# Altium schematic sheet CLK_Distribution.SchDoc
size 420 x 297 mm; EDA_Number: ARTIQ; CompanyName: WUT ISE; Organization: WUT ISE; DocumentNumber: 5; SheetNumber: 8; ModifiedBy: -; Title2: Clock distribution; ModifiedDate: -
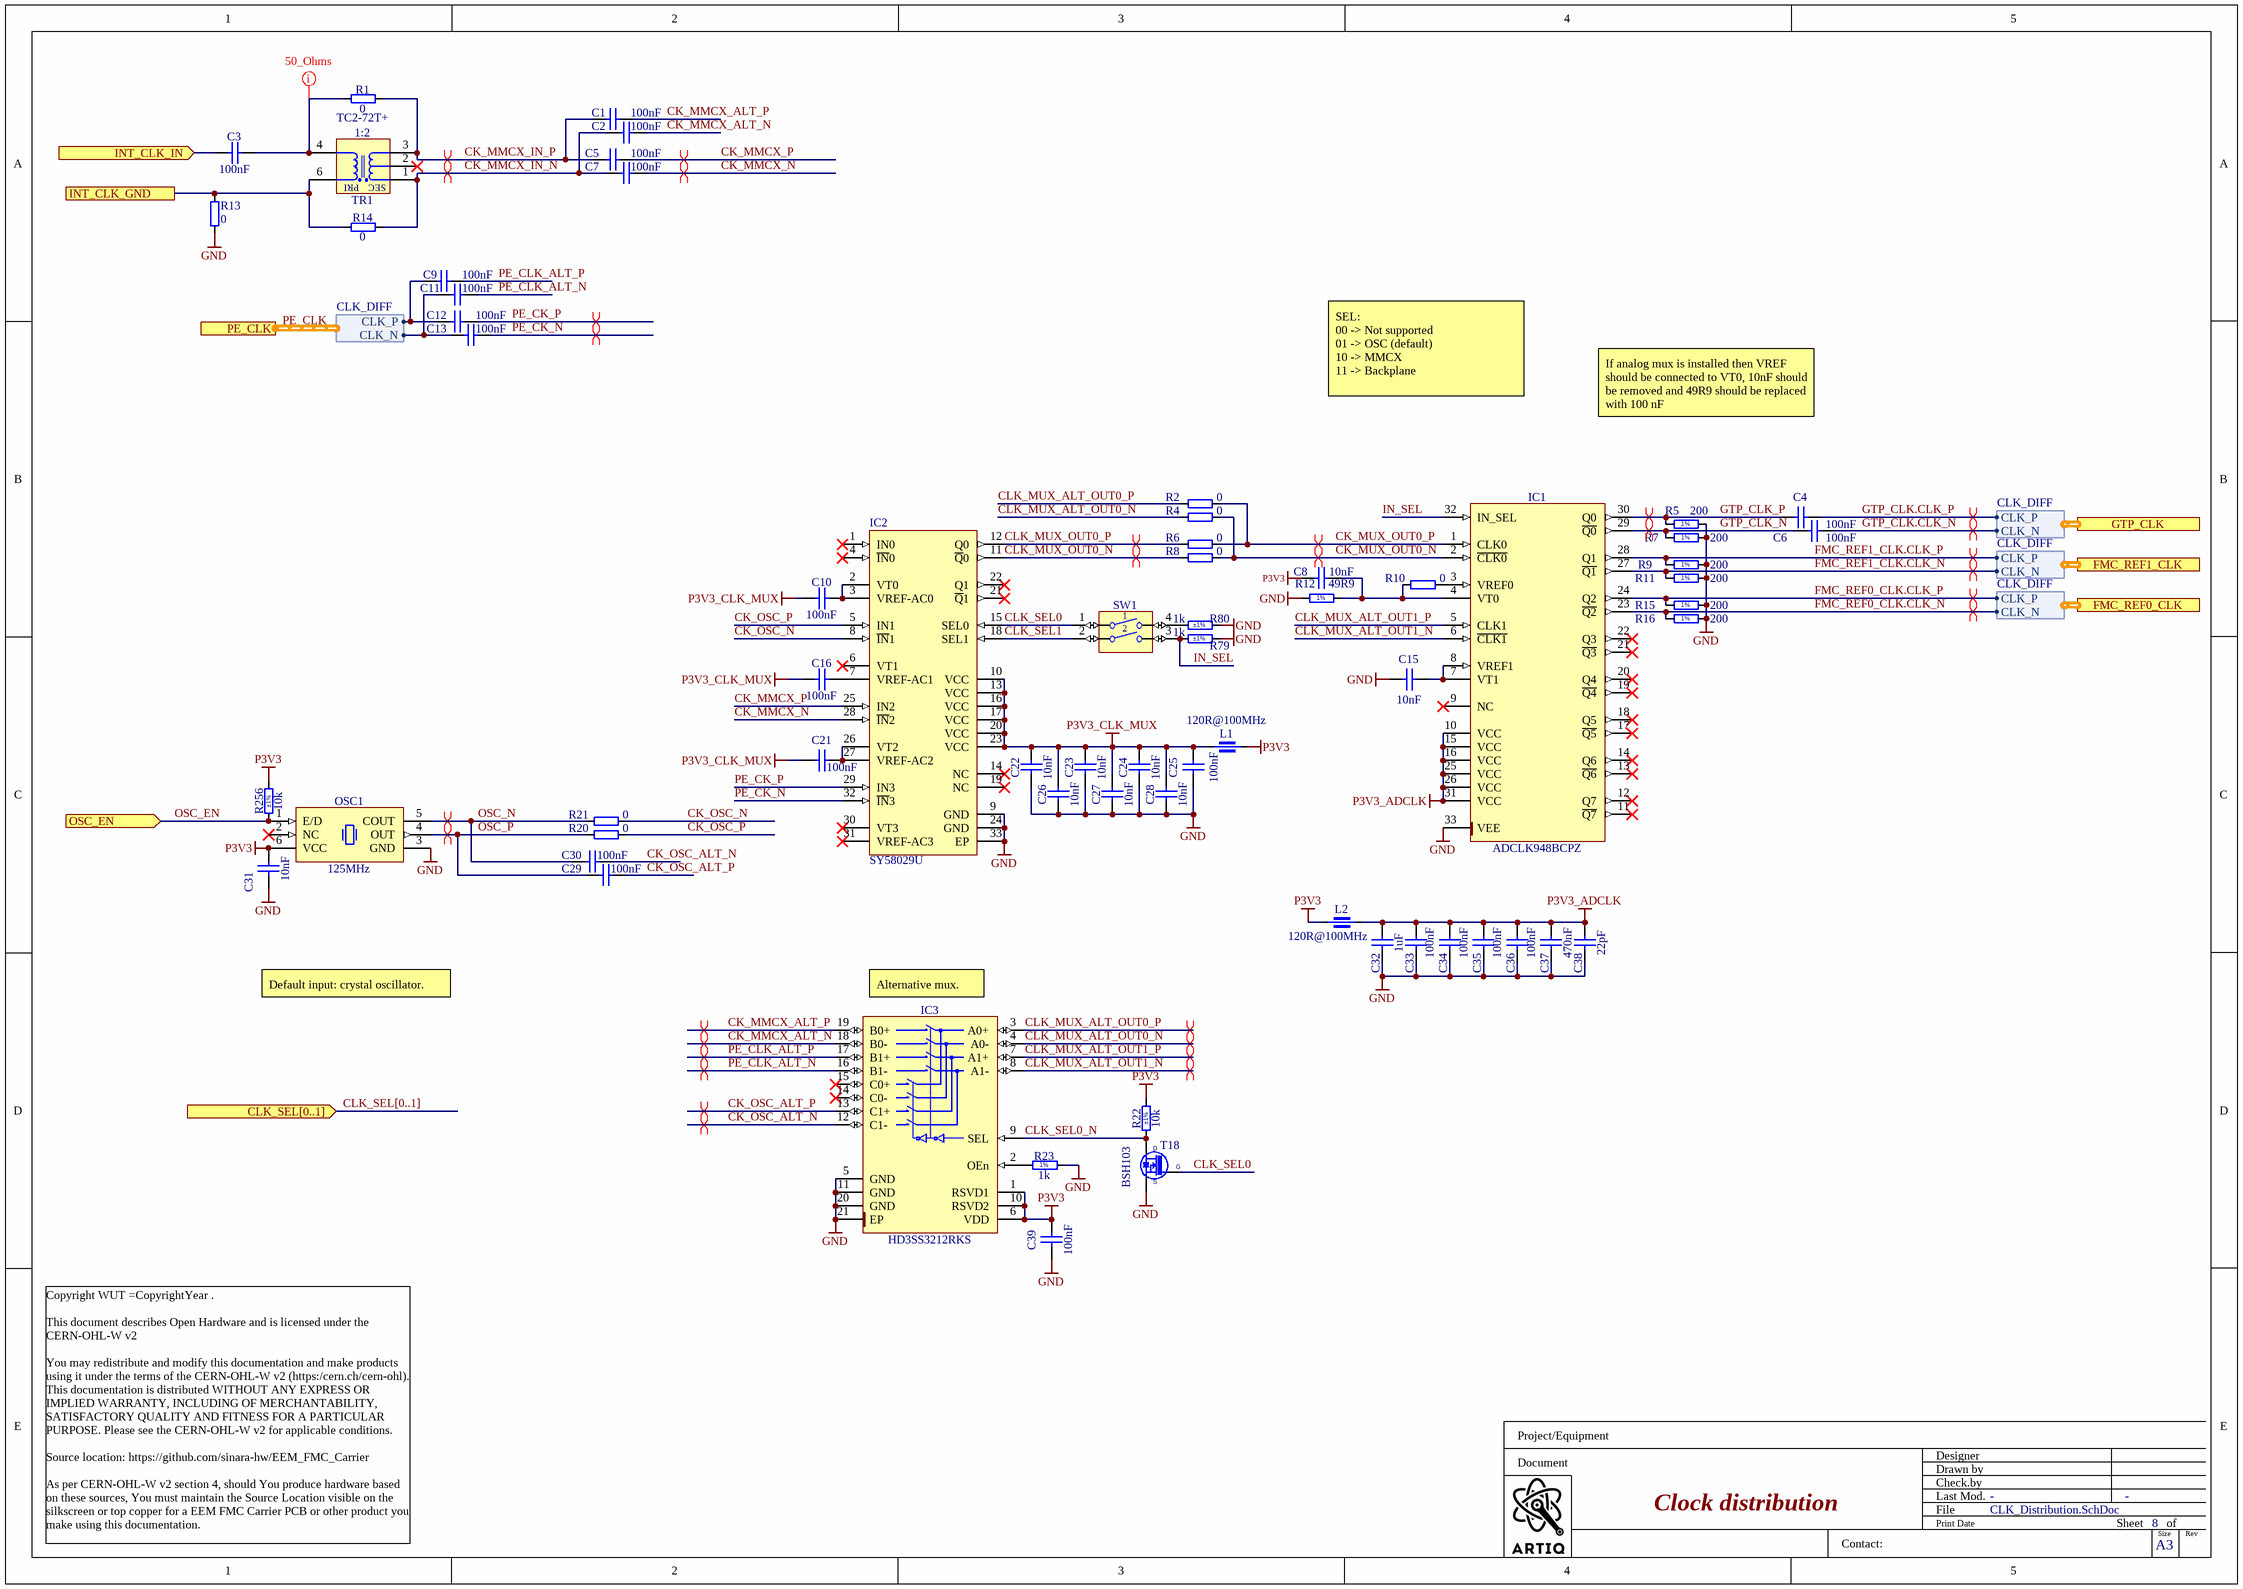
[diagram p0: CLK_Distribution.SchDoc]

## Parts
C1  100nF  [CAPC1005X55N]
C2  100nF  [CAPC1005X55N]
C3  100nF  [CAPC1005X55N]
C4  100nF  [CAPC1005X55N]
C5  100nF  [CAPC1005X55N]
C6  100nF  [CAPC1005X55N]
C7  100nF  [CAPC1005X55N]
C8  10nF  [CAPC1005X55N]
C9  100nF  [CAPC1005X55N]
C10  100nF  [CAPC1005X55N]
C11  100nF  [CAPC1005X55N]
C12  100nF  [CAPC1005X55N]
C13  100nF  [CAPC1005X55N]
C15  10nF  [CAPC1005X55N]
C16  100nF  [CAPC1005X55N]
C21  100nF  [CAPC1005X55N]
C22  10nF  [CAPC1005X55N]
C23  10nF  [CAPC1005X55N]
C24  10nF  [CAPC1005X55N]
C25  100nF  [CAPC1005X55N]
C26  10nF  [CAPC1005X55N]
C27  10nF  [CAPC1005X55N]
C28  10nF  [CAPC1005X55N]
C29  100nF  [CAPC1005X55N]
C30  100nF  [CAPC1005X55N]
C31  10nF  [CAPC1005X55N]
C32  1uF  [CAPC1005X55N]
C33  100nF  [CAPC0603X33N]
C34  100nF  [CAPC0603X33N]
C35  100nF  [CAPC0603X33N]
C36  100nF  [CAPC0603X33N]
C37  470nF  [CAPC0603X33N]
C38  22pF  [CAPC1005X55N]
C39  100nF  [CAPC1005X55N]
IC1  ADCLK948BCPZ  [QFN50P500X500X80-33N-S285]
IC2  SY58029U  [MLF-32]
IC3  HD3SS3212RKS  [TEXAS_RKS0020A]
L1  120R@100MHz  [INDC1608X65N]
L2  120R@100MHz  [INDC1608X65N]
OSC1  125MHz  [OSC_CRYSTEK_CCLD-033]
R1  0  [RESC1005X40N]
R2  0  [RESC0603X28N]
R4  0  [RESC0603X28N]
R5  200  [RESC1005X40N]
R6  0  [RESC0603X28N]
R7  200  [RESC1005X40N]
R8  0  [RESC0603X28N]
R9  200  [RESC1005X40N]
R10  0  [RESC0603X28N]
R11  200  [RESC1005X40N]
R12  49R9  [RESC1005X40N]
R13  0  [RESC1005X40N]
R14  0  [RESC1005X40N]
R15  200  [RESC1005X40N]
R16  200  [RESC1005X40N]
R20  0  [RESC1005X40N]
R21  0  [RESC1005X40N]
R22  10k  Tolerance: ±1%  [RESC1005X40N]
R23  1k  [RESC1005X40N]
R79  1k  Tolerance: ±1%  [RESC1005X40N]
R80  1k  Tolerance: ±1%  [RESC1005X40N]
R256  10k  Tolerance: ±1%  [RESC1005X40N]
SW1  Switch  [SW_TYCO_1571983-1]  (value not drawn)
T18  BSH103  [SOT95P230X110-3N]
TR1  1:2  Manufacturer Part Number: TC2-72T+  [XFMR_MINI-CIRCUITS_AT1521]

## Ports
CLK_SEL[0..1] (in), FMC_REF0_CLK (harness CLK_DIFF), FMC_REF1_CLK (harness CLK_DIFF), GTP_CLK (harness CLK_DIFF), INT_CLK_GND, INT_CLK_IN (in), OSC_EN (in), PE_CLK (harness CLK_DIFF)

## Harnesses
CLK_DIFF: CLK_P, CLK_N
CLK_DIFF: CLK_N, CLK_P

## Nets
GND: C15.1 C22.1 C23.1 C24.1 C25.1 C26.1 C27.1 C28.1 C31.1 C32.1 C33.1 C34.1 C35.1 C36.1 C37.1 C38.1 C39.1 IC1.33(VEE) IC2.9(GND) IC2.24(GND) IC2.33(EP) IC3.5(GND) IC3.11(GND) IC3.20(GND) IC3.21(EP) OSC1.3(GND) R5.2 R7.2 R9.2 R11.2 R12.1 R13.1 R15.2 R16.2 R23.2 R79.2 R80.2 T18.2(S)
P3V3: C8.1 C31.2 C39.2 IC3.1(RSVD1) IC3.6(VDD) IC3.10(RSVD2) L1.1 L2.2 OSC1.6(VCC) R22.2 R256.2
P3V3_ADCLK: C32.2 C33.2 C34.2 C35.2 C36.2 C37.2 C38.2 IC1.10(VCC) IC1.15(VCC) IC1.16(VCC) IC1.25(VCC) IC1.26(VCC) IC1.31(VCC) L2.1
P3V3_CLK_MUX: C10.1 C16.1 C21.1 C22.2 C23.2 C24.2 C25.2 C26.2 C27.2 C28.2 IC2.10(VCC) IC2.13(VCC) IC2.16(VCC) IC2.17(VCC) IC2.20(VCC) IC2.23(VCC) L1.2
CK_MMCX_ALT_N: C2.2 IC3.18(B0-)
CK_MMCX_ALT_P: C1.2 IC3.19(B0+)
CK_MMCX_IN_N: C2.1 C7.1 R14.2 TR1.1(SDOT)
CK_MMCX_IN_P: C1.1 C5.1 R1.2 TR1.3(S)
CK_MMCX_N: C7.2 IC2.28(~{IN}2)
CK_MMCX_P: C5.2 IC2.25(IN2)
CK_MUX_OUT0_N: IC1.2(~{CLK0}) R4.2 R8.2
CK_MUX_OUT0_P: IC1.1(CLK0) R2.2 R6.2
CK_OSC_ALT_N: C30.2 IC3.12(C1-)
CK_OSC_ALT_P: C29.2 IC3.13(C1+)
CK_OSC_N: IC2.8(~{IN}1) R21.2
CK_OSC_P: IC2.5(IN1) R20.2
CLK_MUX_ALT_OUT0_N: IC3.4(A0-) R4.1
CLK_MUX_ALT_OUT0_P: IC3.3(A0+) R2.1
CLK_MUX_ALT_OUT1_N: IC1.6(~{CLK1}) IC3.8(A1-)
CLK_MUX_ALT_OUT1_P: IC1.5(CLK1) IC3.7(A1+)
CLK_MUX_OUT0_N: IC2.11(~{Q}0) R8.1
CLK_MUX_OUT0_P: IC2.12(Q0) R6.1
CLK_SEL0: IC2.15(SEL0) SW1.1 T18.1(G)
CLK_SEL0_N: IC3.9(SEL) R22.1 T18.3(D)
CLK_SEL1: IC2.18(SEL1) SW1.2
FMC_REF0_CLK.CLK_N: IC1.23(~{Q2}) R16.1 ; port FMC_REF0_CLK.CLK_N
FMC_REF0_CLK.CLK_P: IC1.24(Q2) R15.1 ; port FMC_REF0_CLK.CLK_P
FMC_REF1_CLK.CLK_N: IC1.27(~{Q1}) R11.1 ; port FMC_REF1_CLK.CLK_N
FMC_REF1_CLK.CLK_P: IC1.28(Q1) R9.1 ; port FMC_REF1_CLK.CLK_P
GTP_CLK.CLK_N: C6.2 ; port GTP_CLK.CLK_N
GTP_CLK.CLK_P: C4.2 ; port GTP_CLK.CLK_P
GTP_CLK_N: C6.1 IC1.29(~{Q0}) R7.1
GTP_CLK_P: C4.1 IC1.30(Q0) R5.1
IN_SEL: IC1.32(IN_SEL) R79.1 SW1.3
INT_CLK_GND: R13.2 R14.1 TR1.6(PDOT) ; port INT_CLK_GND
INT_CLK_IN: C3.1 ; port INT_CLK_IN
OSC_EN: OSC1.1(E/D) R256.1 ; port OSC_EN
OSC_N: C30.1 OSC1.5(COUT) R21.1
OSC_P: C29.1 OSC1.4(OUT) R20.1
PE_CK_N: C13.2 IC2.32(~{IN}3)
PE_CK_P: C12.2 IC2.29(IN3)
PE_CLK.CLK_N: C11.1 C13.1 ; port PE_CLK.CLK_N
PE_CLK.CLK_P: C9.1 C12.1 ; port PE_CLK.CLK_P
PE_CLK_ALT_N: C11.2 IC3.16(B1-)
PE_CLK_ALT_P: C9.2 IC3.17(B1+)
NetC3_2: C3.2 R1.1 TR1.4(P)
NetC8_2: C8.2 IC1.4(VT0) R10.1 R12.2
NetC10_2: C10.2 IC2.2(VT0) IC2.3(VREF-AC0)
NetC15_2: C15.2 IC1.7(VT1) IC1.8(VREF1)
NetC16_2: C16.2 IC2.7(VREF-AC1)
NetC21_2: C21.2 IC2.26(VT2) IC2.27(VREF-AC2)
NetIC1_3: IC1.3(VREF0) R10.2
NetIC3_2: IC3.2(OEn) R23.1
NetR80_1: R80.1 SW1.4

Not connected (* = marked no-connect by the designer): IC1 9(NC)* 11(~{Q7})* 12(Q7)* 13(~{Q6})* 14(Q6)* 17(~{Q5})* 18(Q5)* 19(~{Q4})* 20(Q4)* 21(~{Q3})* 22(Q3)*; IC2 1(IN0)* 4(~{IN}0)* 6(VT1)* 14(NC)* 19(NC)* 21(~{Q}1)* 22(Q1)* 30(VT3)* 31(VREF-AC3)*; IC3 14(C0-)* 15(C0+)*; OSC1 2(NC)*; TR1 2(NC)*

## Buses and harness runs
bus CLK_SEL[0..1] = port CLK_SEL[0..1]
harness PE_CLK = port PE_CLK

## Layout directives
differential pair; differential pair class Diff_100Ohm: CK_MMCX_ALT_N, CK_MMCX_ALT_P, CK_MMCX_IN_N, CK_MMCX_IN_P, CK_MMCX_N, CK_MMCX_P, CK_OSC_ALT_N, CK_OSC_ALT_P, OSC_N, OSC_P, PE_CK_N, PE_CK_P, PE_CLK_ALT_N, PE_CLK_ALT_P
net class 50Ohm: NetC3_2
differential pair; differential pair class LVPECL: CK_MUX_OUT0_N, CK_MUX_OUT0_P, CLK_MUX_ALT_OUT0_N, CLK_MUX_ALT_OUT0_P, CLK_MUX_ALT_OUT1_N, CLK_MUX_ALT_OUT1_P, CLK_MUX_OUT0_N, CLK_MUX_OUT0_P, FMC_REF0_CLK.CLK_N, FMC_REF0_CLK.CLK_P, FMC_REF1_CLK.CLK_N, FMC_REF1_CLK.CLK_P, GTP_CLK.CLK_N, GTP_CLK.CLK_P, GTP_CLK_N, GTP_CLK_P

## Notes on the sheet
- SEL:
  00 -> Not supported
  01 -> OSC (default)
  10 -> MMCX
  11 -> Backplane
- If analog mux is installed then VREF should be connected to VT0, 10nF should be removed and 49R9 should be replaced with 100 nF
- Default input: crystal oscillator.
- (near IC3) Alternative mux.
- Project/Equipment
- Document
- Designer
- Drawn by
- Check.by
- Copyright WUT =CopyrightYear .
  This document describes Open Hardware and is licensed under the CERN-OHL-W v2
  You may redistribute and modify this documentation and make products using it under the terms of the CERN-OHL-W v2 (https:/cern.ch/cern-ohl). This documentation is distributed WITHOUT ANY EXPRESS OR IMPLIED WARRANTY, INCLUDING OF MERCHANTABILITY, SATISFACTORY QUALITY AND FITNESS FOR A PARTICULAR PURPOSE. Please see the CERN-OHL-W v2 for applicable conditions.
  Source location: https://github.com/sinara-hw/EEM_FMC_Carrier
  As per CERN-OHL-W v2 section 4, should You produce hardware based on these sources, You must maintain the Source Location visible on the silkscreen or top copper for a EEM FMC Carrier PCB or other product you make using this documentation.
- Contact:
- File
- Last Mod.
- Print Date
- Sheet
- Size
- A3
- of
- Rev
- (in symbol R0402_1K_1%_0.0625W_100PPM) 1%
- (in symbol R0402_49R9_1%_0.0625W_100PPM) 1%
- (in symbol R0402_200R_1%_0.0625W_100PPM) 1%
- (in symbol XFMR_MINI-CIRCUITS_TC2-72T+) PRI; SEC

## Library data of the parts
C1-C7 C9-C13 C16 C21 C25 C29 C30 = CC0402_100NF_16V_10%_X5R: Non-polarised capacitor; Part Description: SMD Multilayer Chip Ceramic Capacitor; Manufacturer: GENERIC; Manufacturer1 Part Number: GRM155R61C104KA88D; Voltage: 16V; TC: X5R; Tolerance: ±10%; Part Number: CC0402_100NF_16V_10%_X5R; Component Kind: Standard; Component Type: Standard; Pin Count: 2; Value: 100nF; Status: None; Manufacturer Part Number: CC0402_100NF_16V_10%_X5R; Case: 0402; Mounted: Yes; Socket: No; SMD: Yes; Sense: No; Manufacturer1 Example: MURATA; Manufacturer1 ComponentHeight: 0.55mm; HelpURL: \\cern.ch\dfs\Applications\Altium\Datasheets\CC0402_X5R_MURATA_GRM.pdf; Author: CERN DEM JLC; CreateDate: 10.12.2013; LatestRevisionDate: 10.12.2013
C8 C15 C22-C24 C26-C28 C31 = CC0402_10NF_16V_10%_X7R: Non-polarised capacitor; Part Description: SMD Multilayer Chip Ceramic Capacitor; Manufacturer: GENERIC; Manufacturer1 Part Number: 223878715636; Voltage: 16V; TC: X7R; Tolerance: ±10%; Part Number: CC0402_10NF_16V_10%_X7R; Component Kind: Standard; Component Type: Standard; Pin Count: 2; Value: 10nF; Status: Not Recommended; Manufacturer Part Number: CC0402_10NF_16V_10%_X7R; Case: 0402; Mounted: Yes; Socket: No; SMD: Yes; Sense: No; Manufacturer1 Example: PHYCOMP; Manufacturer1 ComponentHeight: 0.55mm; HelpURL: \\cern.ch\dfs\Applications\Altium\Datasheets\CC0402_X7R_PHYCOMP.pdf; Author: CERN DEM JLC
  C8 C15 C22-C24 C26-C28: CreateDate: 2007-12-03; LatestRevisionDate: 2007-12-03
  C31: CreateDate: 03.12.2007; LatestRevisionDate: 03.12.2007
C32 = CC0402_1UF_16V_10%_X5R: Non-polarised capacitor; Part Description: SMD Multilayer Chip Ceramic Capacitor; Manufacturer: GENERIC; Manufacturer1 Part Number: C1005X5R1C105KT; Voltage: 16V; TC: X5R; Tolerance: ±10%; Part Number: CC0402_1UF_16V_10%_X5R; Component Kind: Standard; Component Type: Standard; Pin Count: 2; Value: 1uF; Status: Preferred; Manufacturer Part Number: CC0402_1UF_16V_10%_X5R; Case: 0402; Mounted: Yes; Socket: No; SMD: Yes; Sense: No; Manufacturer1 Example: TDK; Manufacturer1 ComponentHeight: 0.55mm; HelpURL: \\cern.ch\dfs\Applications\Altium\Datasheets\CC0402_X5R_TDK_C.pdf; Author: CERN DEM JLC; CreateDate: 2012-10-25; LatestRevisionDate: 2012-10-25
C33-C36 = CC0201_100NF_6.3V_10%_X5R: Non-polarised capacitor; Part Description: SMD Multilayer Chip Ceramic Capacitor; Manufacturer: GENERIC; Manufacturer1 Part Number: 02016D104KAT2A; Voltage: 6.3V; TC: X5R; Tolerance: ±10%; Part Number: CC0201_100NF_6.3V_10%_X5R; Component Kind: Standard; Component Type: Standard; Pin Count: 2; Value: 100nF; Status: Not Recommended; Manufacturer Part Number: CC0201_100NF_6.3V_10%_X5R; Case: 0201; Mounted: Yes; Socket: No; SMD: Yes; Sense: No; Manufacturer1 Example: AVX; Manufacturer1 ComponentHeight: 0.33mm; HelpURL: \\cern.ch\dfs\Applications\Altium\Datasheets\CC0201_X5R_AVX.pdf; Author: CERN DEM JLC; CreateDate: 2007-12-03; LatestRevisionDate: 2007-12-03
C37 = CC0201_470NF_4V_20%_X5R: Non-polarised capacitor; Part Description: SMD Multilayer Chip Ceramic Capacitor; Manufacturer: GENERIC; Manufacturer1 Part Number: AMK063BJ474MP-F; Voltage: 4V; TC: X5R; Tolerance: ±20%; Part Number: CC0201_470NF_4V_20%_X5R; Component Kind: Standard; Component Type: Standard; Pin Count: 2; Value: 470nF; Status: Not Recommended; Manufacturer Part Number: CC0201_470NF_4V_20%_X5R; Case: 0201; Mounted: Yes; Socket: No; SMD: Yes; Sense: No; Manufacturer1 Example: TAIYO YUDEN; Manufacturer1 ComponentHeight: 0.33mm; HelpURL: \\cern.ch\dfs\Applications\Altium\Datasheets\CC0201_X5R_TAIYO-YUDEN_STANDARD-CLASS2.pdf; Author: CERN DEM JLC; CreateDate: 27.05.2010; LatestRevisionDate: 27.05.2010
C38 = CC0402_22PF_50V_5%_C0G: Non-polarised capacitor; Part Description: SMD Multilayer Chip Ceramic Capacitor; Manufacturer: GENERIC; Manufacturer1 Part Number: C0402C220J5GACTU; Voltage: 50V; TC: C0G/NP0; Tolerance: ±5%; Part Number: CC0402_22PF_50V_5%_C0G; Component Kind: Standard; Component Type: Standard; Pin Count: 2; Value: 22pF; Status: Preferred; Manufacturer Part Number: CC0402_22PF_50V_5%_C0G; Case: 0402; Mounted: Yes; Socket: No; SMD: Yes; Sense: No; Manufacturer1 Example: KEMET; Manufacturer1 ComponentHeight: 0.55mm; HelpURL: \\cern.ch\dfs\Applications\Altium\Datasheets\CC0805_C0G_KEMET_(Commercial Grade).pdf; Author: CERN DEM JLC; CreateDate: 2007-12-03; LatestRevisionDate: 2007-12-03
C39 = CC0402_100NF_25V_10%_X7R_YUDEN_TMK105B7104KVHF: Non-polarised capacitor; Part Description: SMD Multilayer Chip Ceramic Capacitor (High Dielectric Type) for Automotive / Industrial Applications; Manufacturer: TAIYO YUDEN; Voltage: 25V; TC: X7R; Tolerance: ±10%; Part Number: CC0402_100NF_25V_10%_X7R_YUDEN_TMK105B7104KVHF; Component Kind: Standard; Component Type: Standard; Pin Count: 2; Value: 100nF; Status: Not Recommended; Manufacturer Part Number: TMK105B7104KVHF; Case: 0402; Mounted: Yes; Socket: No; SMD: Yes; Sense: No; HelpURL: \\cern.ch\dfs\Applications\Altium\Datasheets\CC0402_TAIYO-YUDEN_TMK105B7104KVHF.pdf; Author: CERN DEM JLC; CreateDate: 10-May-17; LatestRevisionDate: 10-May-17; ComponentHeight: 0.55mm
IC1 = ADCLK948BCPZ: Two Selectable Inputs, 8 LVPECL Outputs, SiGe Clock Fanout Buffer; Manufacturer: ANALOG DEVICES; PressFit: No; Bonding: No; Part Number: ADCLK948BCPZ; Component Kind: Standard; Component Type: Standard; Device: ADCLK948BCPZ; PackageDescription: QFN, 0.50mm Pitch, Square; 32 Pin, 5.00mm L X 5.00mm W X 0.80mm H body (w/Thermal Tab 2.85 X 2.85mm), IPC Medium Density; Part Description: Two Selectable Inputs, 8 LVPECL Outputs, SiGe Clock Fanout Buffer; Manufacturer Part Number: ADCLK948BCPZ; Pin Count: 33; Case: QFN32; Mounted: Yes; Socket: No; SMD: Yes; Sense: No; ComponentHeight: 0.8mm; Author: CERN DEM MR; HelpURL: \\cern.ch\dfs\Applications\Altium\Datasheets\ADCLK948BCPZ.pdf; CreateDate: 2016-11-30; LatestRevisionDate: 2016-11-30
IC2 = SY58029U: ULTRA PRECISION DIFFERENTIAL LVPECL 4:1 MUX with 1:2 FANOUT and INTERNAL TERMINATION; Manufacturer: Microchip; Manufacturer Part Number: SY58029U; Device: SY58029U
IC3 = HD3SS3212RKS: Two-Channel Differential 2:1/1:2 USB3.1 Mux/Demux; Manufacturer: TEXAS INSTRUMENTS; PressFit: No; Bonding: No; Part Number: HD3SS3212RKS; Component Kind: Standard; Component Type: Standard; Device: HD3SS3212RKS; PackageDescription: QFN, TEXAS Case Style RKS, 0.50mm Pitch, Rect.; 20 Pin, 2.50mm L X 4.50mm W X 1.00mm H body (w/Thermal Tab 1.1mm X 3.1mm); Part Description: Two-Channel Differential 2:1/1:2 USB3.1 Mux/Demux; Manufacturer Part Number: HD3SS3212RKS; Pin Count: 21; Case: TQFN20; Mounted: Yes; Socket: No; SMD: Yes; Sense: No; ComponentHeight: 1mm; Author: CERN DEM BC; HelpURL: \\cern.ch\dfs\Applications\Altium\Datasheets\HD3SS3212RKS.pdf; CreateDate: 2019-11-06; LatestRevisionDate: 2019-11-06
L1 L2 = IND0603_MURATA_BLM18SG121TN1D: Part Description: SMD EMIFIL Suppression Chip Ferrite Bead; Manufacturer: MURATA; Power: 3A; Resistance: 0.025R; Tolerance: ±25%; Part Number: IND0603_MURATA_BLM18SG121TN1D; Component Kind: Standard; Component Type: Standard; Pin Count: 2; Value: 120R@100MHz; Status: None; Manufacturer Part Number: BLM18SG121TN1D; Case: 0603; Mounted: Yes; Socket: No; SMD: Yes; Sense: No; ComponentHeight: 0.65mm; HelpURL: \\cern.ch\dfs\Applications\Altium\Datasheets\IND0603_MURATA_BLM18S.pdf; Author: CERN DEM JLC; CreateDate: 23.07.2014; LatestRevisionDate: 25.10.2018
OSC1 = OSC_CRYSTEK_CCLD-033: 3.3V, ± 50ppm, 0°C to +70°C, Surface Mount LVDS Clock Oscillator (CCLD-033 Series); Part Number: OSC_125MHZ_CRYSTEK_CCLD-033-50-125.000; Manufacturer: CRYSTEK CRYSTAL; Manufacturer Part Number: CCLD-033-50-125.000; PressFit: No; Bonding: No; Component Kind: Standard; Component Type: Standard; PackageDescription: Oscillator, Side Concave, 2.54mm Pitch, 6 Pins, 5.00mm L X 7.00mm W X 1.80mm H, CCLD-033 Series; Value: 125MHz; Part Description: 3.3V, ± 50ppm, 0°C to +70°C, Surface Mount LVDS Clock Oscillator (CCLD-033 Series); Pin Count: 6; Mounted: Yes; Socket: No; SMD: Yes; Sense: No; ComponentHeight: 1.8mm; HelpURL: \\cern.ch\dfs\Applications\Altium\Datasheets\OSC_CRYSTEK_CCLD-033.pdf; Author: CERN DEM JLC; CreateDate: 23.02.2017; LatestRevisionDate: 23.02.2017
R1 R13 R14 R20 R21 = R0402_0R_JUMPER: Resistor; Part Description: 1A (0.05R Max DC Resistance) Zero Ohm Jumper; Manufacturer: GENERIC; Manufacturer1 Part Number: 232270591001L; PressFit: No; Part Number: R0402_0R_JUMPER; Component Kind: Standard; Component Type: Standard; Pin Count: 2; Value: 0; Status: Not Recommended; Manufacturer Part Number: R0402_0R_JUMPER; Case: 0402; Mounted: Yes; Sense: No; Socket: No; SMD: Yes; Manufacturer1 Example: YAGEO PHYCOMP; Manufacturer1 ComponentHeight: 0.4mm; HelpURL: \\cern.ch\dfs\Applications\Altium\Datasheets\R0402_Phycomp_RC0402.pdf; Author: CERN DEM JLC; CreateDate: 03.12.2007; LatestRevisionDate: 17.10.2012
R2 R4 R6 R8 R10 = R0201_0R_JUMPER: Resistor; Part Description: 1A (0.05R Max DC Resistance) Zero Ohm Jumper; Manufacturer: GENERIC; Manufacturer1 Part Number: CRCW02010000Z0ED; PressFit: No; Part Number: R0201_0R_JUMPER; Component Kind: Standard; Component Type: Standard; Pin Count: 2; Value: 0; Status: Not Recommended; Manufacturer Part Number: R0201_0R_JUMPER; Case: 0201; Mounted: Yes; Sense: No; Socket: No; SMD: Yes; Manufacturer1 Example: VISHAY; Manufacturer1 ComponentHeight: 0.27mm; HelpURL: \\cern.ch\dfs\Applications\Altium\Datasheets\R0201_VISHAY_CRCW e3.pdf; Author: CERN DEM JLC; CreateDate: 2014-11-19; LatestRevisionDate: 2015-01-08
R5 R7 R9 R11 R15 R16 = R0402_200R_1%_0.0625W_100PPM: Resistor - 1%; Part Description: General Purpose Thick Film Chip Resistor; Manufacturer: GENERIC; Manufacturer1 Part Number: 232270672001L; TC: ±100ppm/°C; PressFit: No; Part Number: R0402_200R_1%_0.0625W_100PPM; Component Kind: Standard; Component Type: Standard; Pin Count: 2; Value: 200; Status: Not Recommended; Power: 0.0625W; Tolerance: ±1%; Manufacturer Part Number: R0402_200R_1%_0.0625W_100PPM; Case: 0402; Mounted: Yes; Sense: No; Socket: No; SMD: Yes; Manufacturer1 Example: YAGEO PHYCOMP; Manufacturer1 ComponentHeight: 0.4mm; HelpURL: \\cern.ch\dfs\Applications\Altium\Datasheets\R0402_Phycomp_RC0402.pdf; Author: CERN DEM JLC; CreateDate: 03.12.2007; LatestRevisionDate: 17.10.2012
R12 = R0402_49R9_1%_0.0625W_100PPM: Resistor - 1%; Part Description: General Purpose Thick Film Chip Resistor; Manufacturer: GENERIC; Manufacturer1 Part Number: 232270674999L or RC0402FR-0749R9L; TC: ±100ppm/°C; PressFit: No; Part Number: R0402_49R9_1%_0.0625W_100PPM; Component Kind: Standard; Component Type: Standard; Pin Count: 2; Value: 49R9; Status: Not Recommended; Power: 0.0625W; Tolerance: ±1%; Manufacturer Part Number: R0402_49R9_1%_0.0625W_100PPM; Case: 0402; Mounted: Yes; Sense: No; Socket: No; SMD: Yes; Manufacturer1 Example: YAGEO PHYCOMP; Manufacturer1 ComponentHeight: 0.4mm; HelpURL: \\cern.ch\dfs\Applications\Altium\Datasheets\R0402_Phycomp_RC0402.pdf; Author: CERN DEM JLC; CreateDate: 24.10.2012; LatestRevisionDate: 24.10.2012
R22 R256 = R0402_10K_1%_0.0625W_100PPM: Resistor - 1%; Part Description: General Purpose Thick Film Chip Resistor; Manufacturer: GENERIC; Manufacturer1 Part Number: 232270671003L; TC: ±100ppm/°C; PressFit: No; Part Number: R0402_10K_1%_0.0625W_100PPM; Component Kind: Standard; Component Type: Standard; Pin Count: 2; Value: 10k; Status: Not Recommended; Power: 0.0625W; Manufacturer Part Number: R0402_10K_1%_0.0625W_100PPM; Case: 0402; Mounted: Yes; Sense: No; Socket: No; SMD: Yes; Manufacturer1 Example: YAGEO PHYCOMP; Manufacturer1 ComponentHeight: 0.4mm; HelpURL: \\cern.ch\dfs\Applications\Altium\Datasheets\R0402_Phycomp_RC0402.pdf; Author: CERN DEM JLC; CreateDate: 2007-12-03; LatestRevisionDate: 2012-10-17
R23 R79 R80 = R0402_1K_1%_0.0625W_100PPM: Resistor - 1%; Part Description: General Purpose Thick Film Chip Resistor; Manufacturer: GENERIC; Manufacturer1 Part Number: 232270671002L; TC: ±100ppm/°C; PressFit: No; Part Number: R0402_1K_1%_0.0625W_100PPM; Component Kind: Standard; Component Type: Standard; Pin Count: 2; Value: 1k; Status: Not Recommended; Power: 0.0625W; Manufacturer Part Number: R0402_1K_1%_0.0625W_100PPM; Case: 0402; Mounted: Yes; Sense: No; Socket: No; SMD: Yes; Manufacturer1 Example: YAGEO PHYCOMP; Manufacturer1 ComponentHeight: 0.4mm; HelpURL: \\cern.ch\dfs\Applications\Altium\Datasheets\R0402_Phycomp_RC0402.pdf; Author: CERN DEM JLC
  R23: Tolerance: ±1%; CreateDate: 2007-12-03; LatestRevisionDate: 2012-10-17
  R79 R80: CreateDate: 03.12.2007; LatestRevisionDate: 17.10.2012
SW1 = SW_TYCO_1571983-1: 2 Ways SPST DIP Switch; Part Description: 2 Way SPST SMD DIP Switch, Latched, Contact Rating 0.025A 24VDC; Manufacturer: TYCO; Manufacturer Part Number: 1571983-1 or GDH02S04; PressFit: No; Part Number: SW_TYCO_1571983-1; Component Kind: Standard; Component Type: Standard; Pin Count: 4; PackageDescription: Pitch 1.27mm,  Body3.66x6.2mm, 2 Ways SPST Surface-Mount DIP Switch, TYCO GDH Series; Family: Switch; Mounted: Yes; Socket: No; SMD: Yes; Sense: No; Status: None; ComponentHeight: 2.31mm; HelpURL: \\cern.ch\dfs\Applications\Altium\Datasheets\SW_TYCO_1571983-1.pdf; Author: CERN DEM JLC; CreateDate: 08.01.2009; LatestRevisionDate: 08.01.2009
T18 = BSH103: N-CHANNEL MOSFET WITH DIODE; Part Description: 30V 850mA N-Channel Enhancement Mode Field-Effect Transistor; Manufacturer: NEXPERIA; PressFit: No; Bonding: No; Part Number: BSH103; Component Kind: Standard; Component Type: Standard; Device: BSH103; PackageDescription: SOT23, 0.95mm Pitch; 3 Pin, 1.30mm W X 2.90mm L X 1.10mm H body, IPC Medium Density; Manufacturer Part Number: BSH103; Pin Count: 3; Case: SOT23-3; Mounted: Yes; Socket: No; SMD: Yes; Sense: No; ComponentHeight: 1.1mm; HelpURL: \\cern.ch\dfs\Applications\Altium\Datasheets\BSH103.pdf; Author: CERN DEM JLC; CreateDate: 16.03.2010; LatestRevisionDate: 20.06.2017
TR1 = XFMR_MINI-CIRCUITS_TC2-72T+: 50 Ohms 10 to 700 MHzz RF Transformer; Part Description: 50 Ohms 10 to 700MHz RF Transformer; Manufacturer: MINI-CIRCUITS; HelpURL: \\cern.ch\dfs\Applications\Altium\Datasheets\XFMR_MINI-CIRCUITS_TC2-1TX+.pdf; Part Number: XFMR_MINI-CIRCUITS_TC2-72T+; Component Kind: Standard; Component Type: Standard; Pin Count: 5; Value: 1:2; Status: None; Mounted: Yes; Socket: No; Sense: No; SMD: Yes; ComponentHeight: 4.06mm; Author: GK; CreateDate: 18.10.2019; LatestRevisionDate: 18.10.2019